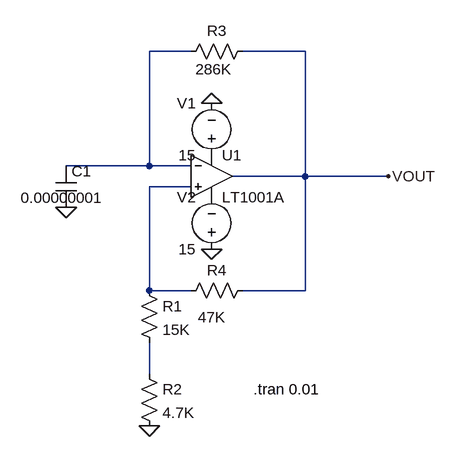
[diagram p0: schematic Square Waveform Generator.asc]
Square Waveform Generator.asc, the LTspice schematic file:
Version 4
SHEET 1 880 680
WIRE 144 -32 80 -32
WIRE 320 -32 224 -32
WIRE 80 144 80 -32
WIRE 80 144 -48 144
WIRE 144 144 80 144
WIRE 320 160 320 -32
WIRE 320 160 208 160
WIRE 448 160 320 160
WIRE 144 176 80 176
WIRE 80 336 80 176
WIRE 144 336 80 336
WIRE 320 336 320 160
WIRE 320 336 224 336
WIRE 80 464 80 416
FLAG 176 48 0
FLAG 176 272 0
FLAG 80 544 0
FLAG -48 208 0
FLAG 448 160 VOUT
SYMBOL OpAmps\\LT1001A 176 96 R0
SYMATTR InstName U1
SYMBOL res 64 320 R0
SYMATTR InstName R1
SYMATTR Value 15K
SYMBOL res 64 448 R0
SYMATTR InstName R2
SYMATTR Value 4.7K
SYMBOL res 240 -48 R90
WINDOW 0 0 56 VBottom 2
WINDOW 3 28 61 VTop 2
SYMATTR InstName R3
SYMATTR Value 286K
SYMBOL res 240 320 R90
WINDOW 0 0 56 VBottom 2
WINDOW 3 41 64 VTop 2
SYMATTR InstName R4
SYMATTR Value 47K
SYMBOL cap -64 144 R0
WINDOW 3 -54 49 Left 2
SYMATTR Value 0.00000001
SYMATTR InstName C1
SYMBOL voltage 176 144 R180
WINDOW 0 24 96 Left 2
WINDOW 3 24 16 Left 2
WINDOW 123 0 0 Left 0
WINDOW 39 0 0 Left 0
SYMATTR InstName V1
SYMATTR Value 15
SYMBOL voltage 176 288 R180
WINDOW 0 24 96 Left 2
WINDOW 3 24 16 Left 2
WINDOW 123 0 0 Left 0
WINDOW 39 0 0 Left 0
SYMATTR InstName V2
SYMATTR Value 15
TEXT 240 488 Left 2 !.tran 0.01

The netlist it stands for:
* Square Waveform Generator.asc
XU1 N002 N001 P001 P002 VOUT LT1001  ; LT1001A, pins In+ In- V+ V- OUT
R1 N002 N003 15K
R2 N003 0 4.7K
R3 VOUT N001 286K
R4 VOUT N002 47K
C1 N001 0 0.00000001
V1 P001 0 15
V2 0 P002 15
.tran 0.01
.lib LTC.lib
.backanno
.end